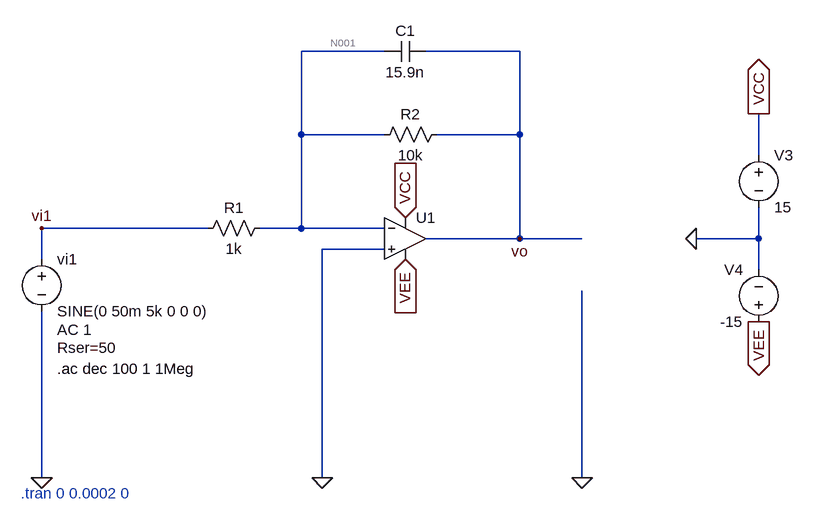
[diagram p0: schematic Lab3p3.asc]
Lab3p3.asc, the LTspice schematic file:
Version 4
SHEET 1 984 856
WIRE 192 -192 64 -192
WIRE 400 -192 256 -192
WIRE 64 -64 64 -192
WIRE 192 -64 64 -64
WIRE 400 -64 400 -192
WIRE 400 -64 272 -64
WIRE 768 -32 768 -96
WIRE -80 80 -336 80
WIRE 64 80 64 -64
WIRE 64 80 0 80
WIRE 192 80 64 80
WIRE 400 96 400 -64
WIRE 400 96 256 96
WIRE 496 96 400 96
WIRE 768 96 768 48
WIRE 768 96 672 96
WIRE 192 112 96 112
WIRE -336 128 -336 80
WIRE 768 144 768 96
WIRE -336 464 -336 208
WIRE 96 464 96 112
WIRE 496 464 496 176
FLAG 224 128 VEE
IOPIN 224 128 In
FLAG 224 64 VCC
IOPIN 224 64 In
FLAG 672 96 0
FLAG 768 -96 VCC
IOPIN 768 -96 Out
FLAG 768 224 VEE
IOPIN 768 224 Out
FLAG 400 96 vo
FLAG 96 464 0
FLAG 496 464 0
FLAG -336 464 0
FLAG -336 80 vi1
SYMBOL OpAmps\\UniversalOpAmp2 224 96 R0
SYMATTR InstName U1
SYMATTR Value2 Avol=200k GBW=1.5Meg Slew=0.5Meg
SYMATTR SpiceLine Ilimit=25m Rail=1 Vos=1m
SYMATTR SpiceLine2 En=0 Enk=0 In=0 Ink=0 Rin=2Meg
SYMBOL voltage 768 -48 R0
SYMATTR InstName V3
SYMATTR Value 15
SYMBOL voltage 768 240 R180
WINDOW 0 24 96 Left 2
WINDOW 3 24 16 Left 2
SYMATTR InstName V4
SYMATTR Value -15
SYMBOL res 16 64 R90
WINDOW 0 0 56 VBottom 2
WINDOW 3 32 56 VTop 2
SYMATTR InstName R1
SYMATTR Value 1k
SYMBOL res 288 -80 R90
WINDOW 0 0 56 VBottom 2
WINDOW 3 32 56 VTop 2
SYMATTR InstName R2
SYMATTR Value 10k
SYMBOL voltage -336 112 R0
WINDOW 123 24 124 Left 2
WINDOW 39 24 152 Left 2
SYMATTR Value2 AC 1
SYMATTR SpiceLine Rser=50
SYMATTR InstName vi1
SYMATTR Value SINE(0 50m 5k 0 0 0)
SYMBOL cap 256 -208 R90
WINDOW 0 0 32 VBottom 2
WINDOW 3 32 32 VTop 2
SYMATTR InstName C1
SYMATTR Value 15.9n
TEXT -368 488 Left 2 ;.tran 0 0.0002 0
TEXT -312 296 Left 2 !.ac dec 100 1 1Meg

The netlist it stands for:
* Lab3p3.asc
XU1 0 N001 VCC VEE vo level2 Avol=200k GBW=1.5Meg Slew=0.5Meg Ilimit=25m Rail=1 Vos=1m En=0 Enk=0 In=0 Ink=0 Rin=2Meg  ; pins In+ In- V+ V- OUT
V3 VCC 0 15
V4 VEE 0 -15
R1 N001 vi1 1k
R2 vo N001 10k
vi1 vi1 0 SINE(0 50m 5k 0 0 0) AC 1 Rser=50
C1 vo N001 15.9n
* .tran 0 0.0002 0
.ac dec 100 1 1Meg
.lib UniversalOpAmp2.lib
.backanno
.end

* Results of the author's LTspice run, read from the files saved beside the schematic
* Operating Point, zero values left out:
*   V(vo) = 10.53 mV
*   V(vcc) = 15 V
*   V(vee) = -15 V
*   V(n001) = 999.9 µV
*   V(vi1) = 47.62 µV
*   I(R1) = 952.3 nA
*   I(R2) = 952.8 nA
*   I(V3) = -1.402 mA
*   I(V4) = 1.401 mA
*   I(Vi1) = 952.3 nA
*   Ix(u1:2) = 500 pA
*   Ix(u1:3) = 1.402 mA
*   Ix(u1:4) = -1.401 mA
*   Ix(u1:5) = -952.8 nA
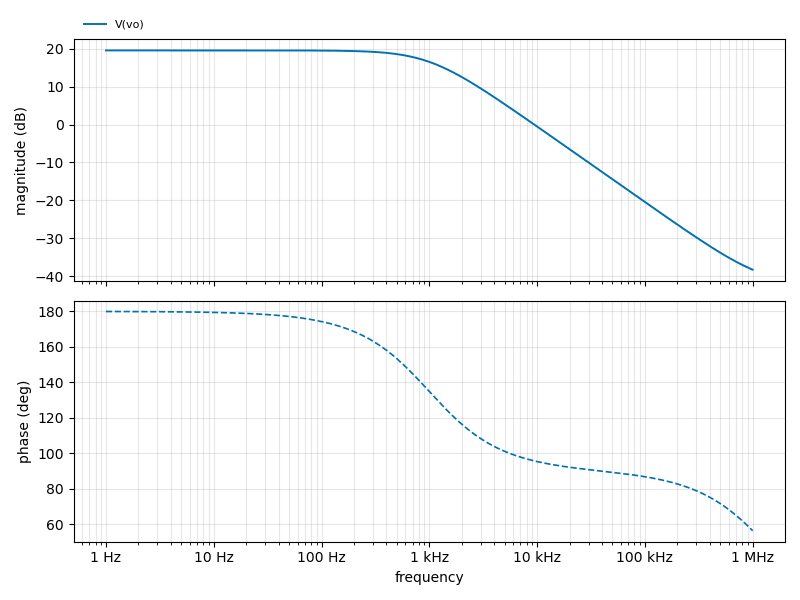
[diagram p1: AC Analysis of Lab3p3.asc, plotted from the saved traces]
* AC Analysis, 1 run:
*   V(vo): 19.58 dB at 1 Hz, -38.30 dB at 1 MHz, peak 19.58 dB at 1 Hz, 3 dB below the peak at 994.6 Hz